# EAGLE design 3-pin-radio-programmer (EAGLE 7.7.0)
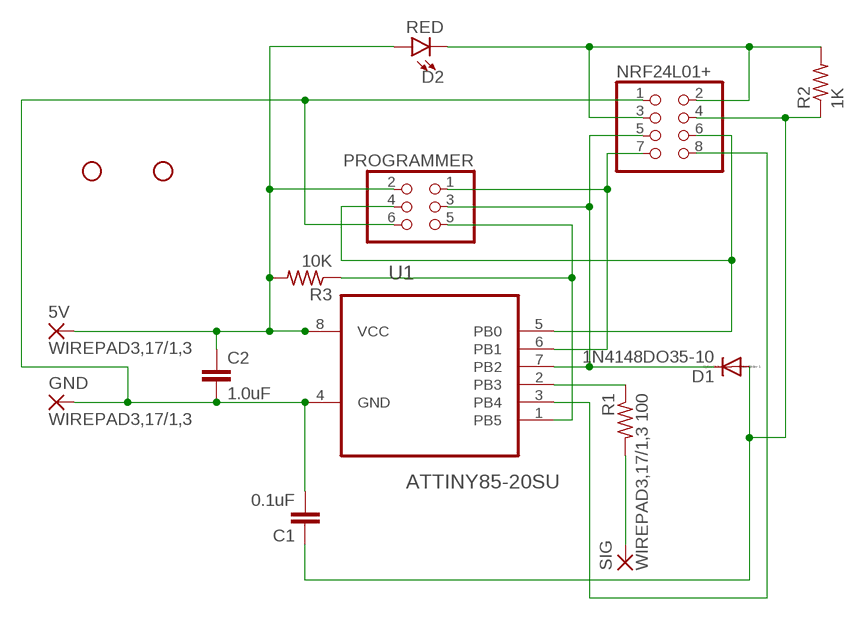
[diagram p0: schematic, sheet 1]

## Parts
5V  WIREPAD3,17/1,3  [3,17/1,3]
C1  0.1uF  0.1UF-0603-25V-5%  [0603]
C2  1.0uF  1.0UF-0603-16V-10%  [0603]
D1  1N4148DO35-10  [DO35-10]
D2  RED  LED3MM  [LED_3MM]
GND  WIREPAD3,17/1,3  [3,17/1,3]
H1  STAND-OFF  [STAND-OFF]
H2  STAND-OFF  [STAND-OFF]
NRF24L01+  PINHD-2X4  [2X04]
PROGRAMMER  PINHD-2X3  [2X03]
R1  100  R-US_R0805  [R0805]
R2  1K  R-US_R0805  [R0805]
R3  10K  R-US_R0805  [R0805]
SIG  WIREPAD3,17/1,3  [3,17/1,3]
U1  ATTINY85-20SU  [SOIC127P798X216-8N]

## Nets
N$1: NRF24L01+.6 PROGRAMMER.4 U1.5(PB0)
N$2: C1.2 C2.2 GND.1(P) NRF24L01+.1 PROGRAMMER.6 U1.4(GND)
N$3: R1.1 U1.2(PB3)
N$4: R1.2 SIG.1(P)
N$6: D1.C NRF24L01+.5 PROGRAMMER.3 U1.7(PB2)
N$7: C1.1 D1.A NRF24L01+.4 R2.1
N$8: D2.K(C) NRF24L01+.2 NRF24L01+.3 R2.2
N$9: NRF24L01+.8 U1.3(PB4)
N$10: NRF24L01+.7 PROGRAMMER.1 U1.6(PB1)
N$11: 5V.1(P) C2.1 D2.A PROGRAMMER.2 R3.2 U1.8(VCC)
N$13: PROGRAMMER.5 R3.1 U1.1(PB5)

## Library data of the parts
5V GND SIG = wirepad:WIREPAD: Wire PAD connect wire on PCB
C1 = SparkFun-Capacitors:0.1UF: 0.1µF ceramic capacitors A capacitor is a passive two-terminal electrical component used to store electrical energy temporarily in an electric field.; PROD_ID: CAP-08604
C2 = SparkFun-Capacitors:1.0UF: 1µF ceramic capacitors A capacitor is a passive two-terminal electrical component used to store electrical energy temporarily in an electric field.; PROD_ID: CAP-00868
D1 = diode:1N4148: DIODE high speed (Philips)
D2 = SparkFun-LED:LED: LED (Generic) Standard schematic elements and footprints for 5mm, 3mm, 1206, and 0603 sized LEDs. Generic LEDs with no color specified.; PROD_ID: DIO-08794
H1 H2 = SparkFun-Hardware:STAND-OFF: Stand Off Drill holes for mechanically mounting via screws, standoffs, etc. Note: Use the keepout ring to avoid running the screw head into surrounding components. Variant Overviews STAND-OFF - Mechanical footprint for a #4 phillips button head screw. STAND-OFF-TIGHT - Mechanical footprint for a #4 phillips button head screw, Example SparkFun Products Screw - Phillips Head (1/4", 4-40, 10 pack) <https://www.sparkfun.com/products/10453> (PRT-10453) Screw - Phillips Head (1/2", 4-40, 10 pack) <https://www.sparkfun.com/products/10452> (PRT-10452) Screw - Phillips Head (3/4", 4-40, 10 pack) <https://www.sparkfun.com/products/10451> (PRT-10451) Screw - Phillips Head (1", 4-40, 10 pack) <https://www.sparkfun.com/products/10450> (PRT-10450)
NRF24L01+ = pinhead:PINHD-2X4: PIN HEADER
PROGRAMMER = pinhead:PINHD-2X3: PIN HEADER
R1-R3 = rcl:R-US_: RESISTOR, American symbol
U1 = Atmel_By_element14_Batch_1-00:ATTINY85-20SU: 8-bit Microcontroller with In-System Programmable Flash; MPN: ATTINY85-20SU; OC_FARNELL: 1455164; OC_NEWARK: 58M3797; PACKAGE: SOIC-8; SUPPLIER: Atmel

## Board
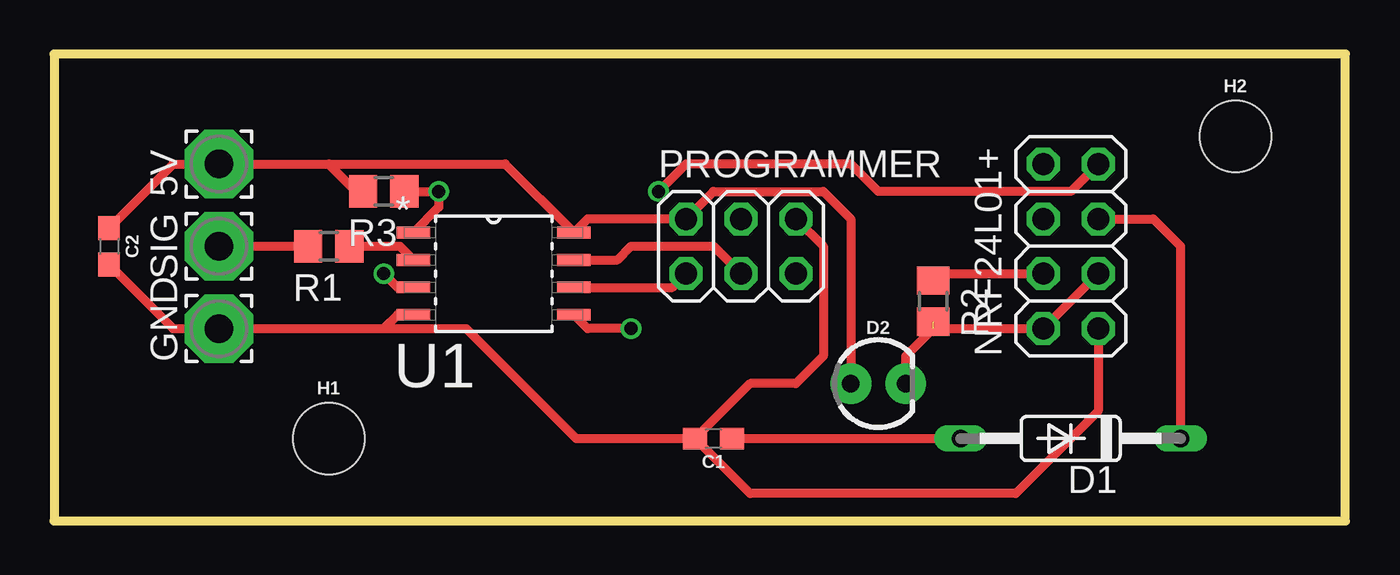
[diagram p1: board, top side]
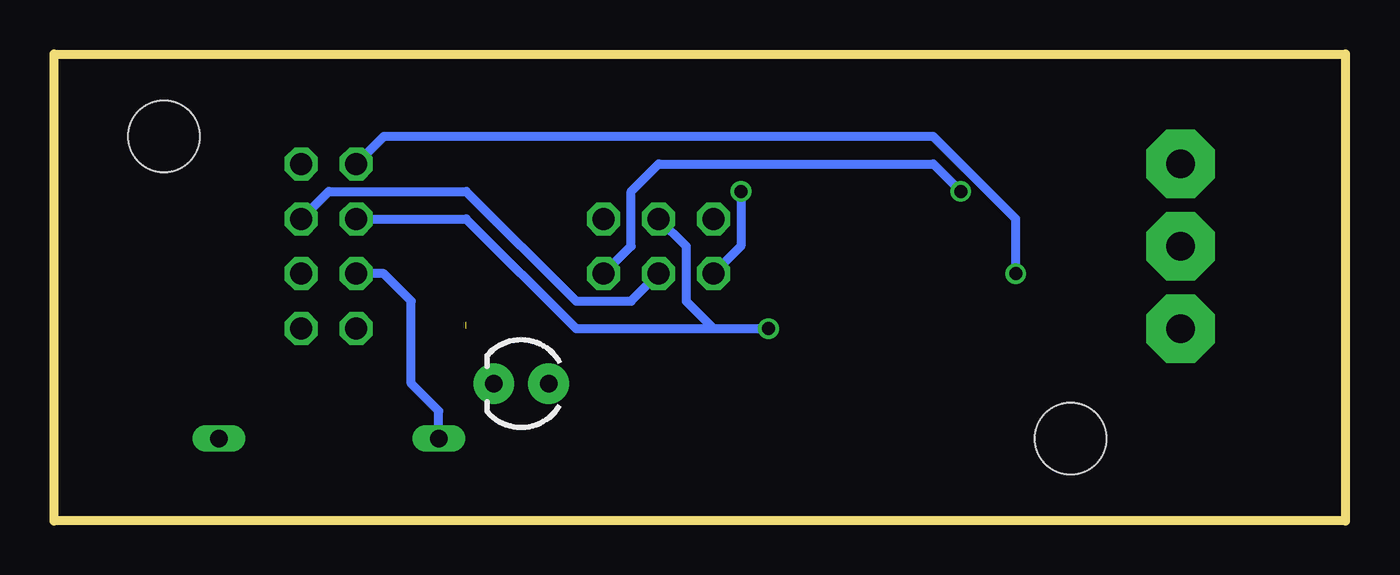
[diagram p2: board, bottom side, seen from below]

Size 59.69 x 21.59 mm. Coordinates in mm from the lower left corner, seen from the top.
Outline: 0,0 59.69,0 59.69,21.59 0,21.59 0,0
Copper layers (1*16): Top 0.0356mm / dielectric 1.5011mm / Bottom 0.0356mm
Design rules "OshPark": minimum track width 6mil, minimum drill 13mil, track to track 6mil, track to pad 6mil, pad to pad 6mil, via to via 6mil, smd to smd 6mil, copper to edge 15mil, drill to drill 6mil, minimum pad ring 7mil, minimum via ring 7mil, stop-mask expansion 3mil, vias tented up to drill 0mil, thermal gap 10mil

### Footprints (pad centres in the part's own frame; a part is rotated, then mirrored left to right if it is on the bottom)
3,17/1,3 = drill 1.321 pad 3.175 octagon: 1 0,0
0603 = smd 1.1 x 1: 1 -0.85,0; 2 0.85,0
DO35-10 = drill 0.813 long: A 5.08,0; C -5.08,0
LED_3MM = drill 0.813 pad 1.88: A -1.27,0; K 1.27,0
STAND-OFF = hole 3.302: 0,0
2X04 = drill 1.016 octagon: 1 -3.81,-1.27; 2 -3.81,1.27; 3 -1.27,-1.27; 4 -1.27,1.27; 5 1.27,-1.27; 6 1.27,1.27; 7 3.81,-1.27; 8 3.81,1.27
2X03 = drill 1.016 octagon: 1 -2.54,-1.27; 2 -2.54,1.27; 3 0,-1.27; 4 0,1.27; 5 2.54,-1.27; 6 2.54,1.27
R0805 = smd 1.3 x 1.5: 1 -0.95,0; 2 0.95,0
SOIC127P798X216-8N = smd 1.549 x 0.533: 1 -3.708,1.905; 2 -3.708,0.635; 3 -3.708,-0.635; 4 -3.708,-1.905; 5 3.708,-1.905; 6 3.708,-0.635; 7 3.708,0.635; 8 3.708,1.905

### Placement (x,y rotation side)
5V  7.62,16.51 90 top
C1  30.48,3.81 180 top
C2  2.54,12.7 270 top
D1  46.99,3.81 180 top
D2  38.1,6.35 0 top
GND  7.62,8.89 90 top
H1  12.7,3.81 0 top
H2  54.61,17.78 0 top
NRF24L01+  46.99,12.7 90 top
PROGRAMMER  31.75,12.7 0 top
R1  12.7,12.7 180 top
R2  40.64,10.16 270 top
R3  15.24,15.24 180 top
SIG  7.62,12.7 90 top
U1  20.32,11.43 0 top

### Tracks (layer width: path | path; a pad name or v marks a point on that pad's centre or on a via)
N$1  (via drill 0.6)
  Top 0.406: v26.67,8.89 24.66,8.89 U1.5
  Bottom 0.406: NRF24L01+.6 40.64,13.97 35.56,8.89 29.21,8.89 | 29.21,8.89 v26.67,8.89 | PROGRAMMER.4 30.48,12.7 30.48,10.16 29.21,8.89
N$2
  Top 0.406: C2.2 5.5,8.89 GND.1 15.24,8.89 | NRF24L01+.1 48.26,5.08 44.45,1.27 32.17,1.27 C1.2 | 15.24,8.89 19.05,8.89 24.13,3.81 C1.2 | U1.4 15.88,9.53 15.24,8.89 | PROGRAMMER.6 35.56,12.7 35.56,7.62 34.29,6.35 32.17,6.35 C1.2
N$3
  Top 0.406: R1.1 15.98,12.7 U1.2
N$4
  Top 0.406: SIG.1 R1.2
N$6
  Top 0.406: NRF24L01+.5 50.8,13.97 52.07,12.7 D1.C | U1.7 26.04,12.06 26.67,12.7 30.48,12.7 PROGRAMMER.3
  Bottom 0.406: NRF24L01+.5 46.99,15.24 40.64,15.24 35.56,10.16 33.02,10.16 PROGRAMMER.3
N$7
  Top 0.406: C1.1 D1.A | R2.1 40.96,11.43 NRF24L01+.4
  Bottom 0.406: D1.A 41.91,5.08 43.18,6.35 43.18,10.16 44.45,11.43 NRF24L01+.4
N$8  (1 unrouted)
  Top 0.406: R2.2 40.96,8.89 NRF24L01+.2 NRF24L01+.3 | D2.K 39.37,7.62 40.64,8.89
N$9  (via drill 0.6)
  Top 0.406: U1.3 15.88,10.79 v15.24,11.43
  Bottom 0.406: v15.24,11.43 15.24,13.97 19.05,17.78 44.45,17.78 NRF24L01+.8
N$10  (via drill 0.6)
  Top 0.406: U1.6 28.57,10.79 PROGRAMMER.1 | NRF24L01+.7 46.99,15.24 38.1,15.24 36.83,16.51 29.21,16.51 v27.94,15.24
  Bottom 0.406: v27.94,15.24 27.94,12.7 PROGRAMMER.1
N$11
  Top 0.406: C2.1 5.5,16.51 5V.1 12.7,16.51 | 12.7,16.51 20.85,16.51 U1.8 24.66,13.97 PROGRAMMER.2 30.48,15.24 35.56,15.24 36.83,13.97 D2.A | R3.2 13.97,15.24 12.7,16.51
N$13  (via drill 0.6)
  Top 0.406: U1.1 17.78,14.5 v17.78,15.24 R3.1
  Bottom 0.406: PROGRAMMER.5 33.02,12.7 33.02,15.24 31.75,16.51 19.05,16.51 v17.78,15.24